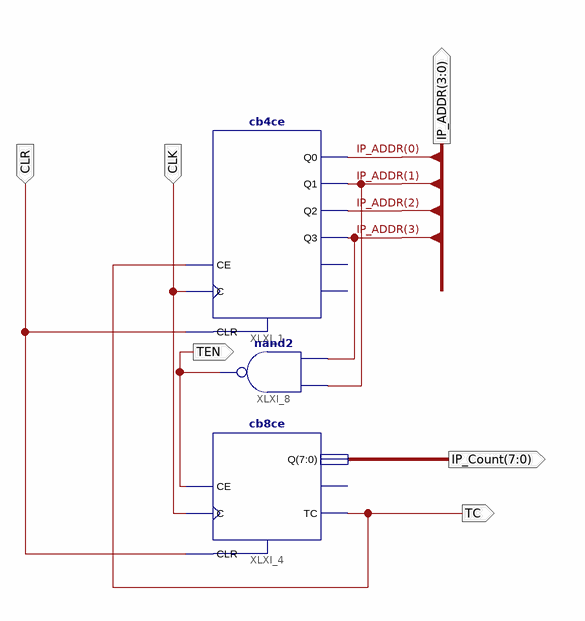
[diagram p0: schematic sheet 1]
// Xilinx ISE schematic Counters.sch (spartan3e) as structural Verilog: 3 symbols, 6 ports
module Counters (
  input  CLK,
  input  CLR,
  output TC,
  output [7:0] IP_Count,
  output [3:0] IP_ADDR,
  output TEN
);

  cb4ce XLXI_1 (
    .C(CLK), .CE(TC), .CLR(CLR), .Q0(IP_ADDR[0]), .Q1(IP_ADDR[1]), .Q2(IP_ADDR[2]), .Q3(IP_ADDR[3]));  // open: CEO, TC
  cb8ce XLXI_4 (.C(CLK), .CE(TEN), .CLR(CLR), .Q(IP_Count), .TC(TC));  // open: CEO
  nand XLXI_8 (TEN, IP_ADDR[3], IP_ADDR[1]);
endmodule
